# Altium schematic sheet regulators.SchDoc
size A
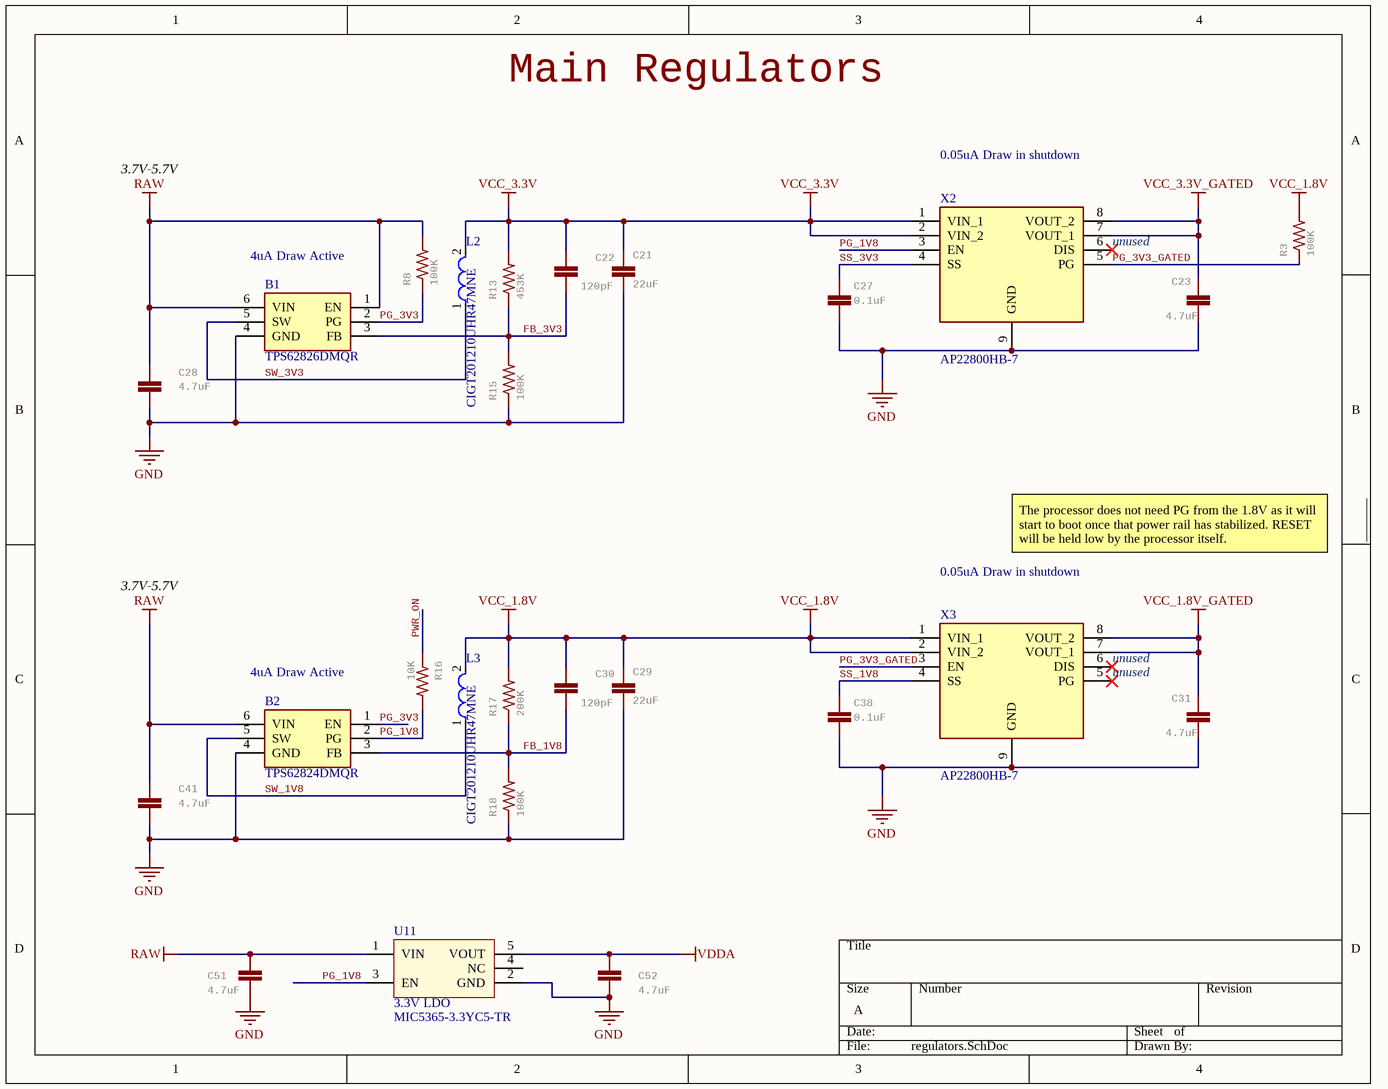
[diagram p0: regulators.SchDoc]

## Parts
B1  TPS62826DMQR  [TPS62826ADMQR]
B2  TPS62824DMQR  [TPS62826ADMQR]
C21  22uF  [0805]
C22  120pF  [0402-CAP]
C23  4.7uF  [0402-CAP]
C27  0.1uF  [0402-CAP]
C28  4.7uF  [0402-CAP]
C29  22uF  [0805]
C30  120pF  [0402-CAP]
C31  4.7uF  [0402-CAP]
C38  0.1uF  [0402-CAP]
C41  4.7uF  [0402-CAP]
C51  4.7uF  [0402-CAP]
C52  4.7uF  [0402-CAP]
L2  CIGT201210UHR47MNE  [0805]
L3  CIGT201210UHR47MNE  [0805]
R3  100K  [0402-RES]
R8  100K  [0402-RES]
R13  453K  [0402-RES]
R15  100K  [0402-RES]
R16  10K  [0402-RES]
R17  200K  [0402-RES]
R18  100K  [0402-RES]
U11  3.3V LDO  [SC70-5]
X2  AP22800HB-7  [SON50P161X211X60-9N]
X3  AP22800HB-7  [SON50P161X211X60-9N]

## Nets
GND: B1.4(GND) B2.4(GND) C21.2 C23.2 C27.1 C28.1 C29.2 C31.2 C38.1 C41.1 C51.1 C52.2 R15.1 R18.1 U11.2(GND) X2.9(GND) X3.9(GND)
RAW: B1.1(EN) B1.6(VIN) B2.6(VIN) C28.2 C41.2 C51.2 R8.2 U11.1(VIN)
VCC_1.8V: C29.1 C30.2 L3.2 R3.2 R17.2 X3.1(VIN_1) X3.2(VIN_2)
VCC_1.8V_GATED: C31.1 X3.7(VOUT_1) X3.8(VOUT_2)
VCC_3.3V: C21.1 C22.2 L2.2 R13.2 X2.1(VIN_1) X2.2(VIN_2)
VCC_3.3V_GATED: C23.1 X2.7(VOUT_1) X2.8(VOUT_2)
VDDA: C52.1 U11.5(VOUT)
FB_1V8: B2.3(FB) C30.1 R17.1 R18.2
FB_3V3: B1.3(FB) C22.1 R13.1 R15.2
PG_1V8: B2.2(PG) R16.2 U11.3(EN) X2.3(EN)
PG_3V3: B1.2(PG) B2.1(EN) R8.1
PG_3V3_GATED: R3.1 X2.5(PG) X3.3(EN)
PWR_ON: R16.1
SS_1V8: C38.2 X3.4(SS)
SS_3V3: C27.2 X2.4(SS)
SW_1V8: B2.5(SW) L3.1
SW_3V3: B1.5(SW) L2.1

Not connected (* = marked no-connect by the designer): U11 4(NC); X2 6(DIS)*; X3 5(PG)* 6(DIS)*

## Notes on the sheet
- Main Regulators
- 3.7V-5.7V
- 0.05uA Draw in shutdown
- (near X2) unused
- (near B1) 4uA Draw Active
- The processor does not need PG from the 1.8V as it will start to boot once that power rail has stabilized. RESET will be held low by the processor itself.
- (near B2) 4uA Draw Active
- (near X3) unused

## Library data of the parts
B1 = TPS62826ADMQR: Switching Voltage Regulators 2.4-V to 5.5-V input, 3-A step-down converter with in 1.5-mm 1.5-mm QFN package; Manufacturer_Name: Texas Instruments; Geometry.Height: 1mm; Mouser Part Number: 595-TPS62826DMQR; Mouser Price/Stock: https://www.mouser.co.uk/ProductDetail/Texas-Instruments/TPS62826ADMQR?qs=KUoIvG%2F9Ila3pPUbedlDEw%3D%3D; Manufacturer_Part_Number: TPS62826DMQR; Datasheet Link: https://www.ti.com/lit/ds/symlink/tps62825a.pdf?ts=1608196934558&ref_url=https%253A%252F%252Fwww.ti.com%252Fstore%252Fti%252Fen%252Fp%252Fproduct%252F%253Fp%253DTPS62825ADMQR%2526keyMatch%253DTPS62825ADMQR%2526tisearch%253DSearch-EN-everything%2526usecase; MPN: TPS62826DMQR; Part Number: TPS62826DMQR
B2 = TPS62826ADMQR: Switching Voltage Regulators 2.4-V to 5.5-V input, 1-A step-down converter in 1.5-mm 1.5-mm QFN package; Manufacturer_Name: Texas Instruments; Geometry.Height: 1mm; Mouser Part Number: 595-TPS62824DMQR; Mouser Price/Stock: https://www.mouser.co.uk/ProductDetail/Texas-Instruments/TPS62826ADMQR?qs=KUoIvG%2F9Ila3pPUbedlDEw%3D%3D; Manufacturer_Part_Number: TPS62824DMQR; Datasheet Link: https://www.ti.com/lit/ds/symlink/tps62825a.pdf?ts=1608196934558&ref_url=https%253A%252F%252Fwww.ti.com%252Fstore%252Fti%252Fen%252Fp%252Fproduct%252F%253Fp%253DTPS62825ADMQR%2526keyMatch%253DTPS62825ADMQR%2526tisearch%253DSearch-EN-everything%2526usecase; MPN: TPS62824DMQR; Part Number: TPS62824DMQR
C21 C29 = 22UF-0805-6.3V-20%: 22ÂµF ceramic capacitors    A capacitor is a passive two-terminal electrical component used to store electrical energy temporarily in an electric field.; MPN: CL21A226MQQNNNE; GateName_1: G$1; SymbolName_1: CAP; PROD_ID: CAP-08402; DeviceName: -0805-6.3V-20%; LibraryName: SparkFun-Capacitors; DeviceSetName: 22UF; Part Number: CL21A226MQQNNNE
C22 C30 = CAP0402-CAP: CapacitorStandard 0603 ceramic capacitor, and 0.1" leaded capacitor.; MPN: GRM1555C2A121GE01D; GateName_1: G$1; SymbolName_1: CAP; DeviceName: 0402-CAP; LibraryName: sfe; DeviceSetName: CAP; Part Number: GRM1555C2A121GE01D
C23 C28 C31 C41 C51 C52 = CAP0402-CAP: CapacitorStandard 0603 ceramic capacitor, and 0.1" leaded capacitor.; MPN: JMK105BBJ475MV-F; GateName_1: G$1; SymbolName_1: CAP; DeviceName: 0402-CAP; LibraryName: sfe; DeviceSetName: CAP; Part Number: JMK105BBJ475MV-F
C27 C38 = C-EUC0201: CAPACITOR, European symbol; MPN: C0402C104Z4VAC; GateName_1: G$1; SymbolName_1: C-EU; POPULARITY: 0; LibraryName: rcl; DeviceSetName: C-EU; SPICEPREFIX: C; Part Number: C0402C104Z4VAC
L2 L3 = CMP-00002-1: Power Inductor : LxW size(mm) 2012 Thickness1 Inductance (uH) 20%: 0.47; Current Rating: 3.6A; Shielding: Unshielded; Test Frequency: 1MHz; DC Resistance (DCR): 31mR; Saturation Current: 5.4A; Core Material: Metal,Composite; Value: 470nH; Tolerance: 20%; Packaging: Cut Tape; Case Code (Imperial): 0805; Case/Package: 0805; RoHS Compliant: Yes; Max Operating Temperature: 125°C; Series: CIGT; Min Operating Temperature: -40°C; Mounting Technology: Surface Mount; Case Code (Metric): 2012; MPN: CIGT201210UHR47MNE; Part Number: CIGT201210UHR47MNE
R3 R8 R15 R18 = RESISTOR0402-RES: ResistorBasic schematic elements and footprints for 0603, 1206, and PTH resistors.; MPN: AC0402FR-07100KL; GateName_1: G$1; SymbolName_1: RESISTOR; DeviceName: 0402-RES; LibraryName: sfe; DeviceSetName: RESISTOR; Part Number: AC0402FR-07100KL
R13 = RESISTOR0402-RES: ResistorBasic schematic elements and footprints for 0603, 1206, and PTH resistors.; MPN: CR0402-FX-4533GLF; GateName_1: G$1; SymbolName_1: RESISTOR; DeviceName: 0402-RES; LibraryName: sfe; DeviceSetName: RESISTOR; Part Number: CR0402-FX-4533GLF
R16 = RESISTOR0402-RES: ResistorBasic schematic elements and footprints for 0603, 1206, and PTH resistors.; MPN: AC0402FR-1310KL; GateName_1: G$1; SymbolName_1: RESISTOR; DeviceName: 0402-RES; LibraryName: sfe; DeviceSetName: RESISTOR; Part Number: AC0402FR-1310KL
R17 = RESISTOR0402-RES: ResistorBasic schematic elements and footprints for 0603, 1206, and PTH resistors.; MPN: CR0402-FX-2003GLF; GateName_1: G$1; SymbolName_1: RESISTOR; DeviceName: 0402-RES; LibraryName: sfe; DeviceSetName: RESISTOR; Part Number: CR0402-FX-2003GLF
U11 = MIC5365-3.3YC5-TR: MF: Microchip; MPN: MIC5365-3.3YC5-TR
X2 X3 = AP22800HB-7: Power Switch ICs - Power Distribution Load Switch; Manufacturer_Name: Diodes Incorporated; Geometry.Height: 0.605mm; Mouser Part Number: 621-AP22800HB-7; Mouser Price/Stock: https://www.mouser.co.uk/ProductDetail/Diodes-Incorporated/AP22800HB-7?qs=9BjnSzo86S%2FcRh3gewZ%2Ftg%3D%3D; Manufacturer_Part_Number: AP22800HB-7; Datasheet Link: https://www.diodes.com/assets/Datasheets/AP22800.pdf; MPN: AP22800HB-7; Part Number: AP22800HB-7